# EAGLE board M837cc (EAGLE 6.6.0), part 1 of 2
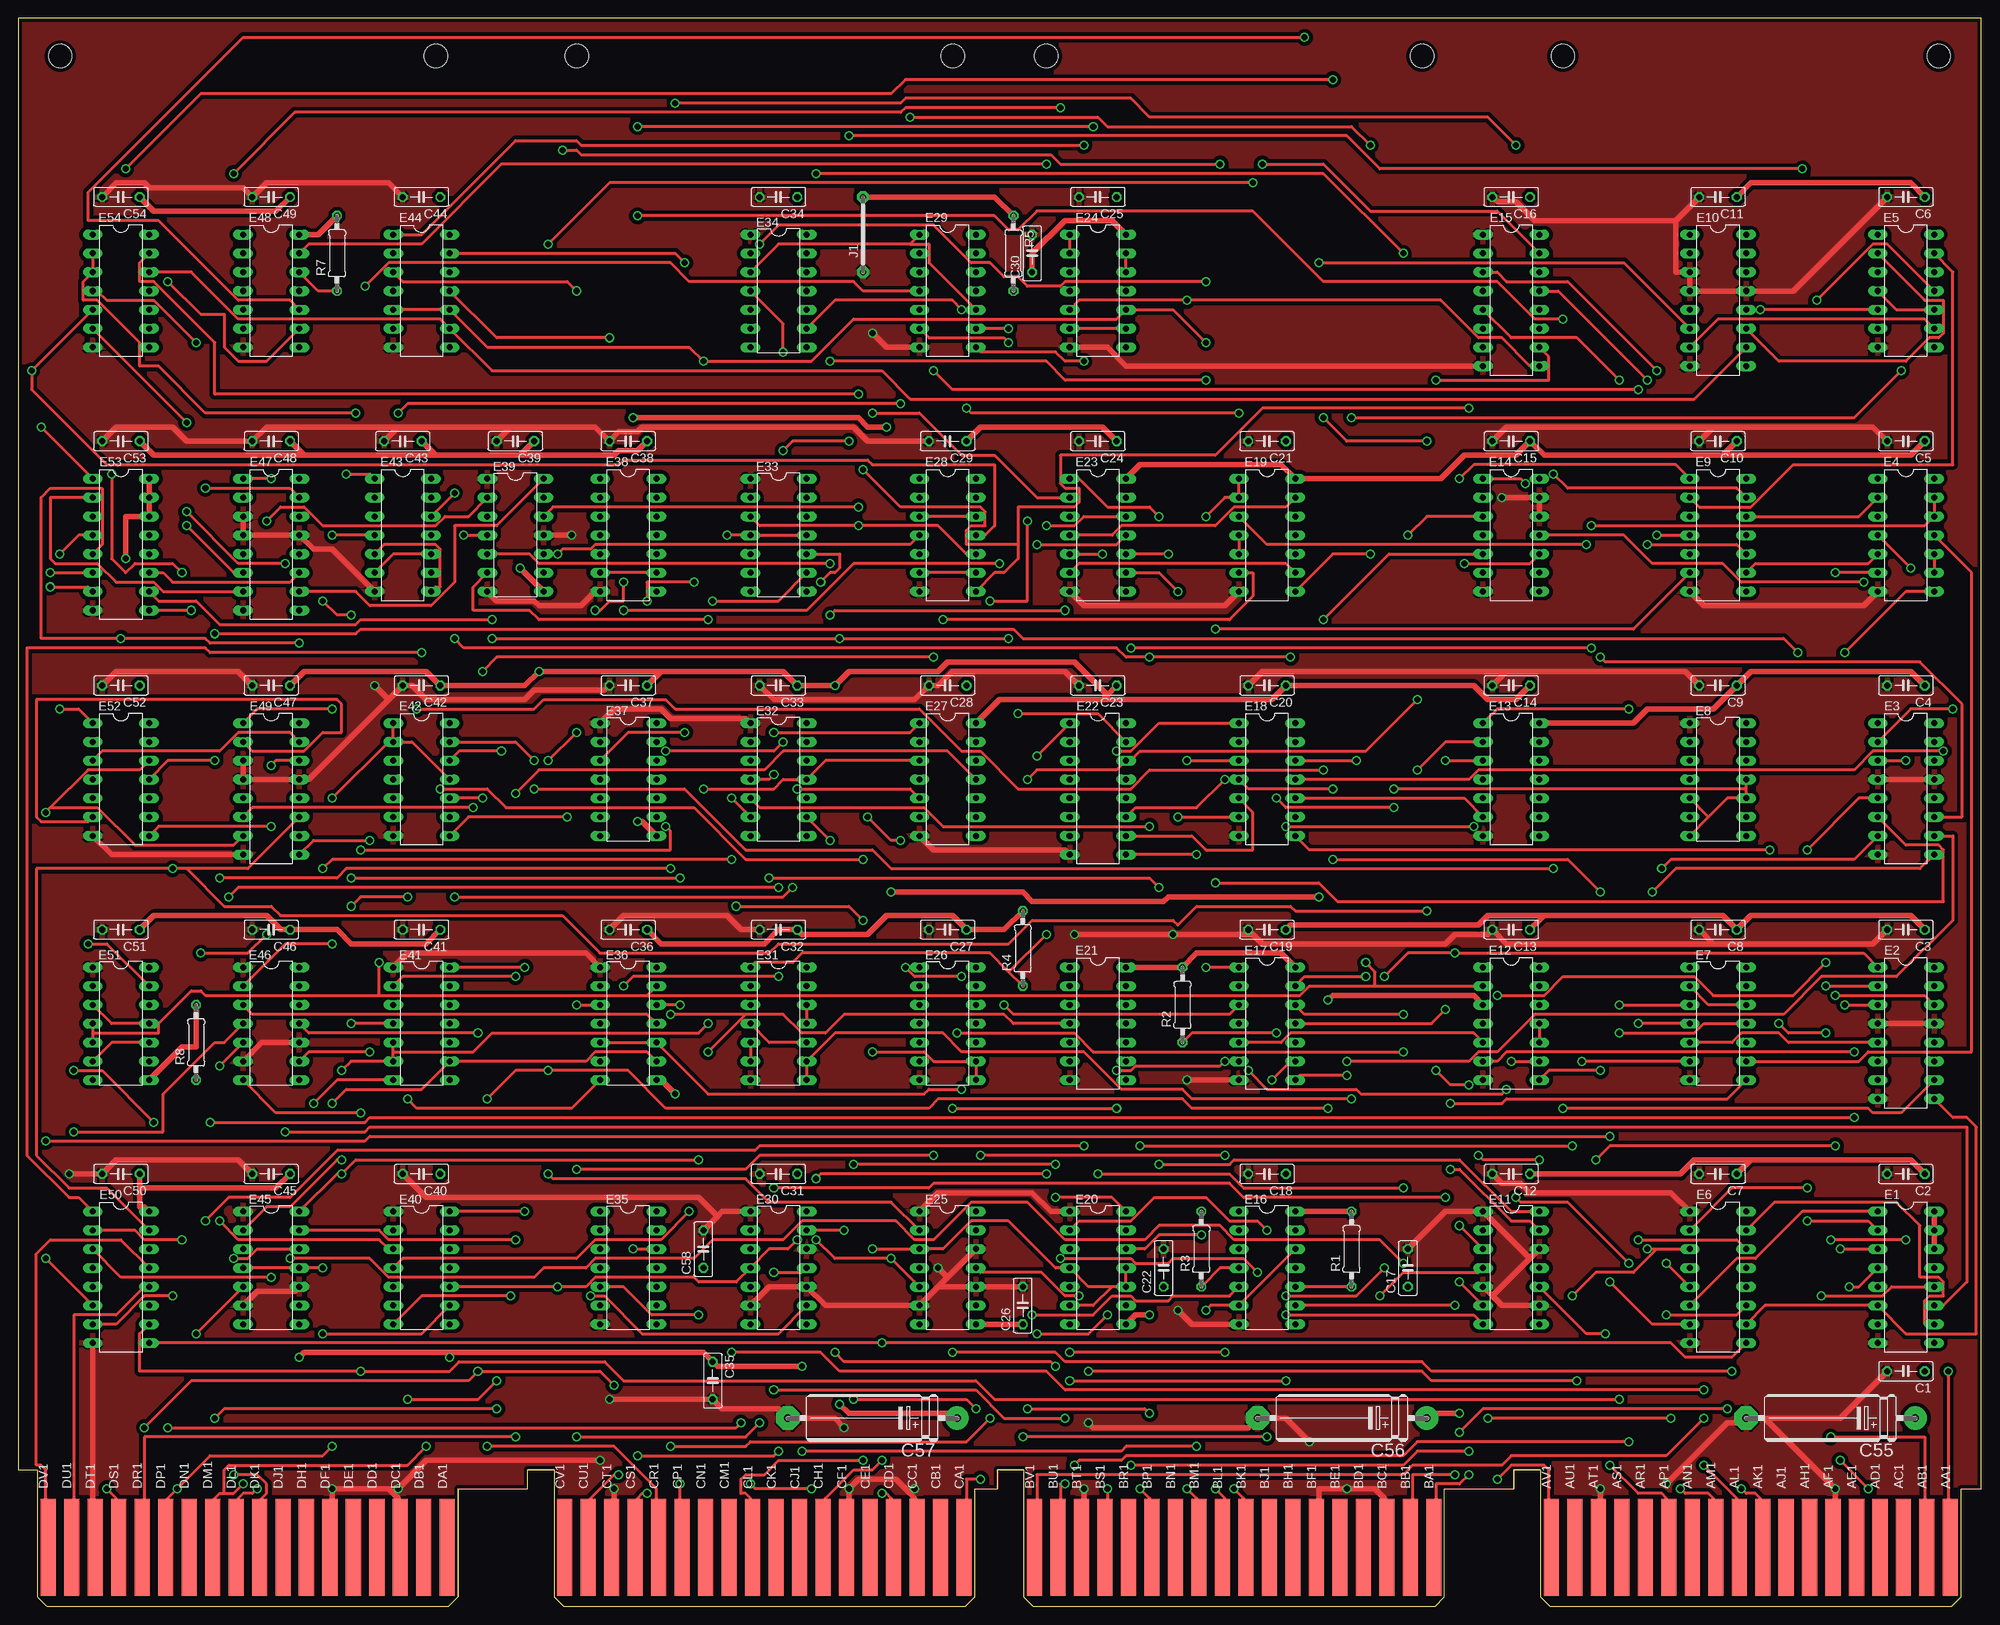
[diagram p7: board, top side]
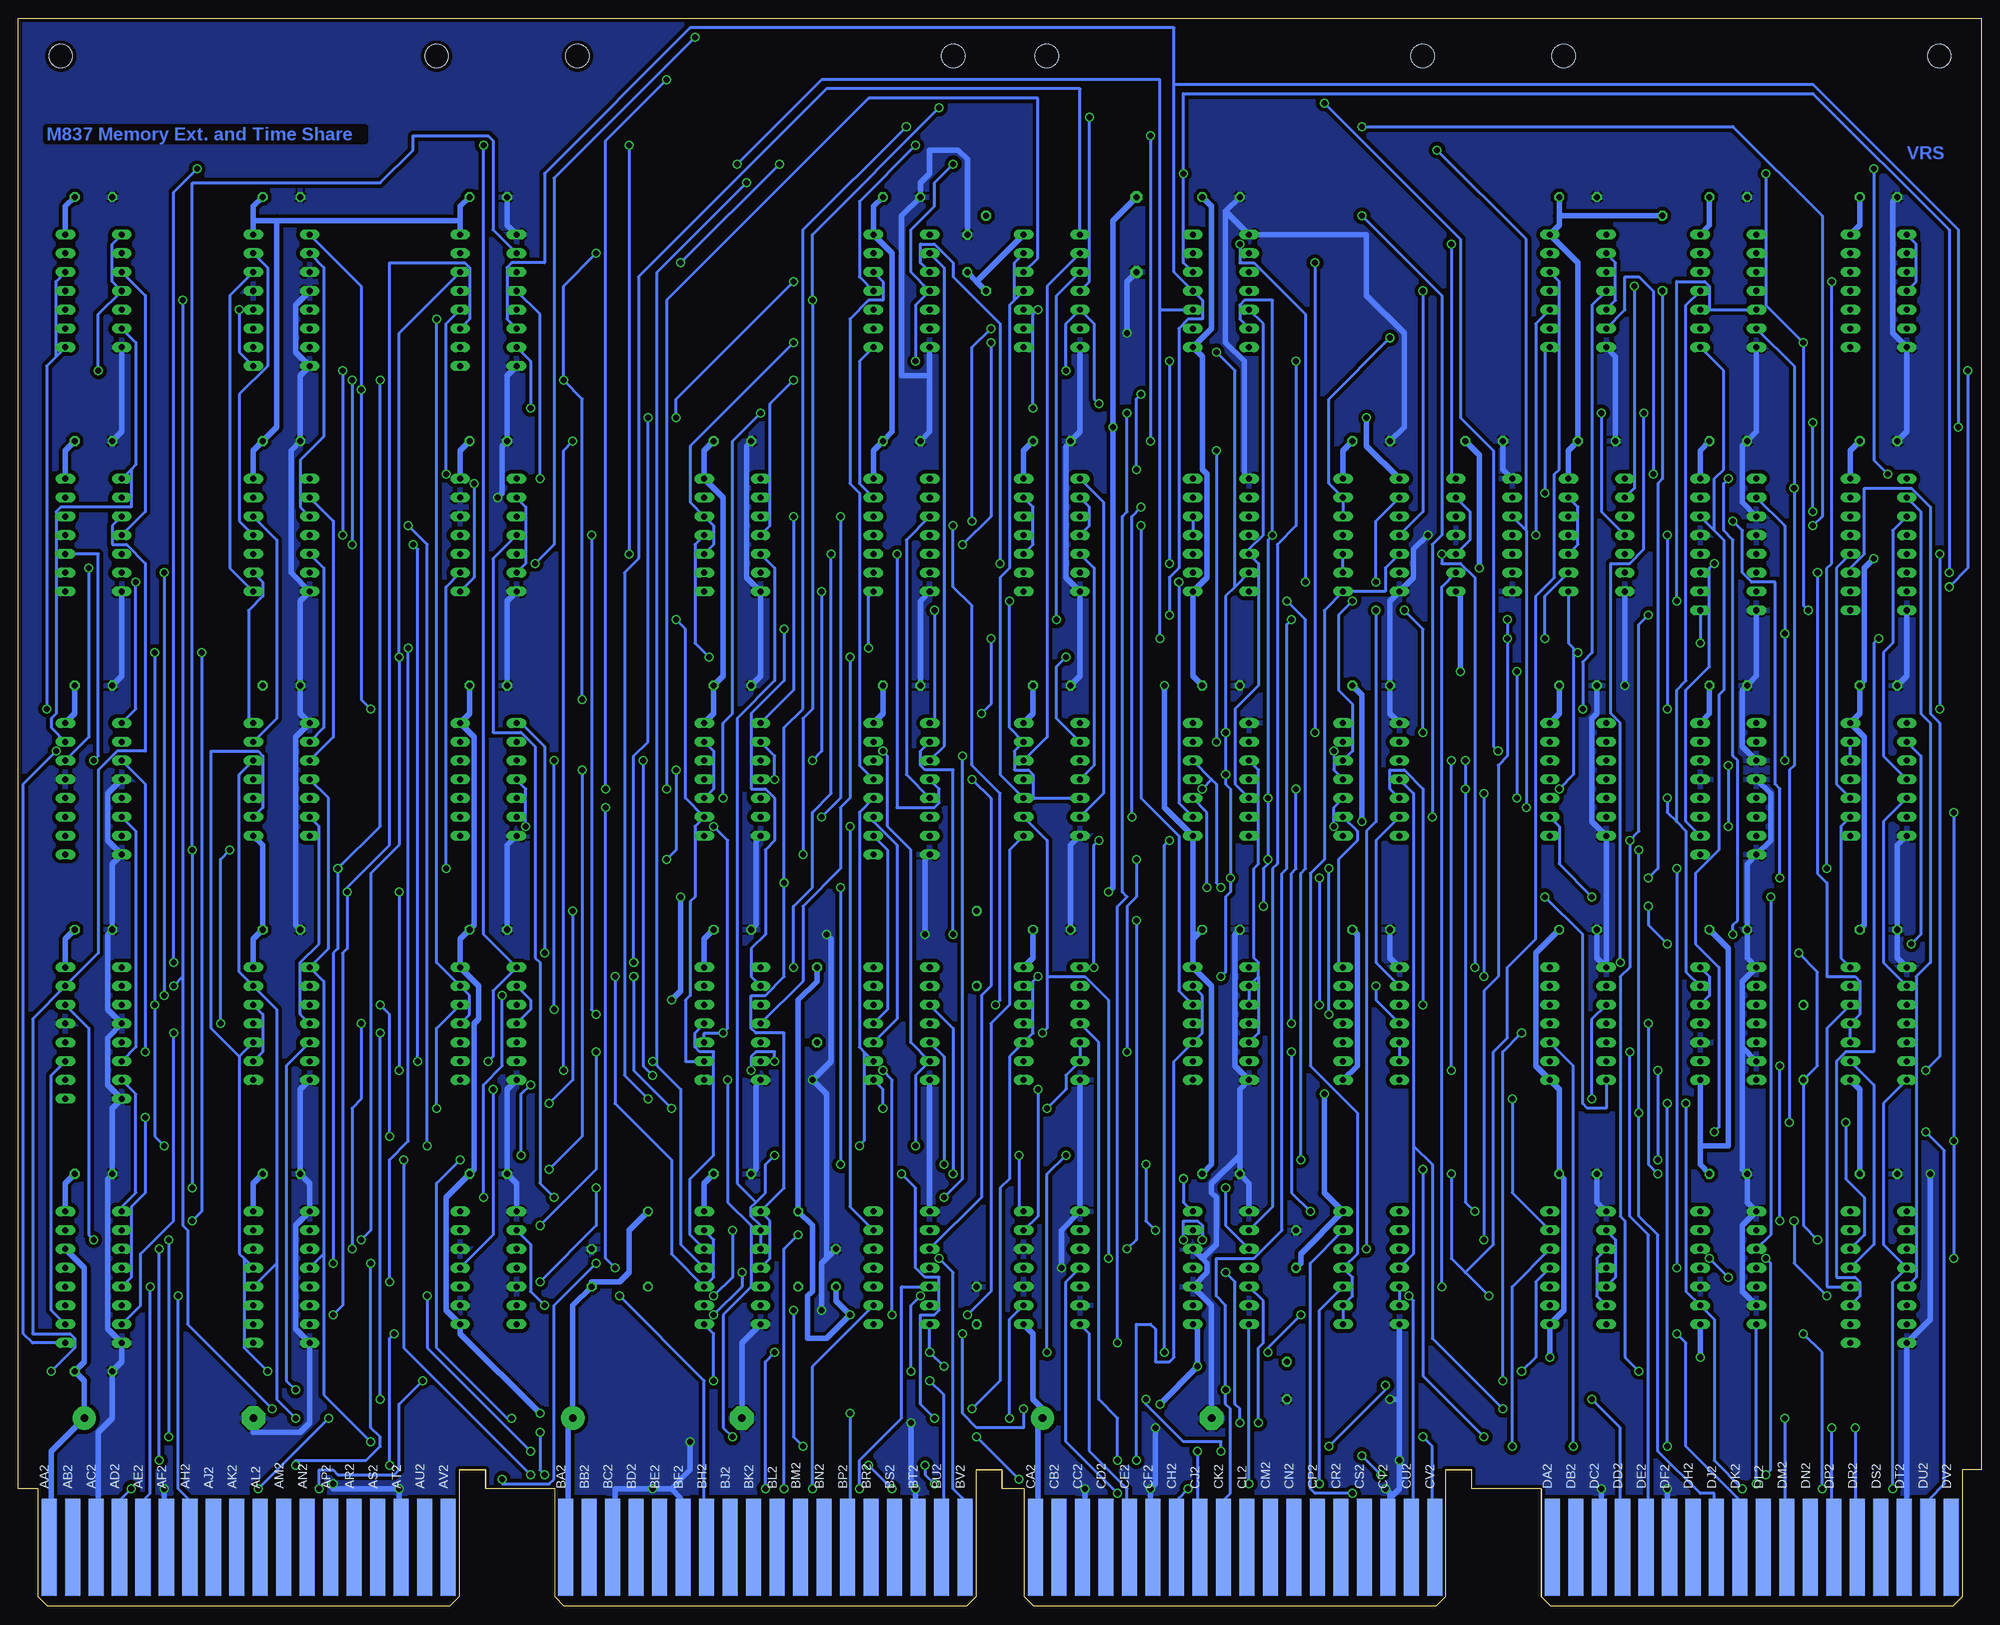
[diagram p8: board, bottom side, seen from below]

Size 265.3 x 214.63 mm. Coordinates in mm from the lower left corner, seen from the top.
Copper layers (1+16): Top 0.035mm / dielectric 1.5mm / Bottom 0.035mm
Design rules "16mils": minimum track width 16mil, minimum drill 32mil, track to track 15mil, track to pad 10mil, pad to pad 10mil, via to via 10mil, smd to smd 10mil, copper to edge 13mil, drill to drill 10mil, minimum pad ring 10mil, minimum via ring 8mil, stop-mask expansion 0mil, vias tented up to drill 0mil, thermal gap 10mil
Net classes: 1 Supply: width 0.762 mm, drill 0.762 mm, clearance 0.508 mm

## Footprints (pad centres in the part's own frame; a part is rotated, then mirrored left to right if it is on the bottom)
C050-025X075 = drill 0.813 octagon: 1 -2.54,0; 2 2.54,0
E22-6 = drill 1.016 pad 3.15: + -11.43,0 | drill 1.016 pad 3.15 octagon: - 11.43,0
DIL16 = drill 0.813 long: 1 -8.89,-3.81; 2 -6.35,-3.81; 3 -3.81,-3.81; 4 -1.27,-3.81; 5 1.27,-3.81; 6 3.81,-3.81; 7 6.35,-3.81; 8 8.89,-3.81; 9 8.89,3.81; 10 6.35,3.81; 11 3.81,3.81; 12 1.27,3.81; 13 -1.27,3.81; 14 -3.81,3.81; 15 -6.35,3.81; 16 -8.89,3.81
DIL14 = drill 0.813 long: 1 -7.62,-3.81; 2 -5.08,-3.81; 3 -2.54,-3.81; 4 0,-3.81; 5 2.54,-3.81; 6 5.08,-3.81; 7 7.62,-3.81; 8 7.62,3.81; 9 5.08,3.81; 10 2.54,3.81; 11 0,3.81; 12 -2.54,3.81; 13 -5.08,3.81; 14 -7.62,3.81
EDGE-CON8 = smd 2.032 x 13.106: AA1 261.303,7.938; AB1 258.127,7.938; AC1 254.952,7.938; AD1 251.778,7.938; AE1 248.602,7.938; AF1 245.428,7.938; AH1 242.252,7.938; AJ1 239.077,7.938; AK1 235.903,7.938; AL1 232.727,7.938; AM1 229.553,7.938; AN1 226.377,7.938; AP1 223.202,7.938; AR1 220.028,7.938; AS1 216.852,7.938; AT1 213.678,7.938; AU1 210.502,7.938; AV1 207.327,7.938; BA1 191.452,7.938; BB1 188.278,7.938; BC1 185.102,7.938; BD1 181.928,7.938; BE1 178.752,7.938; BF1 175.577,7.938; BH1 172.403,7.938; BJ1 169.227,7.938; BK1 166.053,7.938; BL1 162.877,7.938; BM1 159.702,7.938; BN1 156.528,7.938; BP1 153.352,7.938; BR1 150.178,7.938; BS1 147.002,7.938; BT1 143.827,7.938; BU1 140.653,7.938; BV1 137.477,7.938; CA1 127.953,7.938; CB1 124.778,7.938; CC1 121.603,7.938; CD1 118.427,7.938; CE1 115.252,7.938; CF1 112.078,7.938; CH1 108.903,7.938; CJ1 105.728,7.938; CK1 102.552,7.938; CL1 99.377,7.938; CM1 96.203,7.938; CN1 93.028,7.938; CP1 89.853,7.938; CR1 86.677,7.938; CS1 83.502,7.938; CT1 80.328,7.938; CU1 77.153,7.938; CV1 73.978,7.938; DA1 58.102,7.938; DB1 54.928,7.938; DC1 51.752,7.938; DD1 48.578,7.938; DE1 45.403,7.938; DF1 42.227,7.938; DH1 39.053,7.938; DJ1 35.877,7.938; DK1 32.703,7.938; DL1 29.527,7.938; DM1 26.352,7.938; DN1 23.177,7.938; DP1 20.003,7.938; DR1 16.828,7.938; DS1 13.652,7.938; DT1 10.477,7.938; DU1 7.303,7.938; DV1 4.128,7.938 | smd 2.032 x 13.106 bottom: AA2 261.303,7.938; AB2 258.127,7.938; AC2 254.952,7.938; AD2 251.778,7.938; AE2 248.602,7.938; AF2 245.428,7.938; AH2 242.252,7.938; AJ2 239.077,7.938; AK2 235.903,7.938; AL2 232.727,7.938; AM2 229.553,7.938; AN2 226.377,7.938; AP2 223.202,7.938; AR2 220.028,7.938; AS2 216.852,7.938; AT2 213.678,7.938; AU2 210.502,7.938; AV2 207.327,7.938; BA2 191.452,7.938; BB2 188.278,7.938; BC2 185.102,7.938; BD2 181.928,7.938; BE2 178.752,7.938; BF2 175.577,7.938; BH2 172.403,7.938; BJ2 169.227,7.938; BK2 166.053,7.938; BL2 162.877,7.938; BM2 159.702,7.938; BN2 156.528,7.938; BP2 153.352,7.938; BR2 150.178,7.938; BS2 147.002,7.938; BT2 143.827,7.938; BU2 140.653,7.938; BV2 137.477,7.938; CA2 127.953,7.938; CB2 124.778,7.938; CC2 121.603,7.938; CD2 118.427,7.938; CE2 115.252,7.938; CF2 112.078,7.938; CH2 108.903,7.938; CJ2 105.728,7.938; CK2 102.552,7.938; CL2 99.377,7.938; CM2 96.203,7.938; CN2 93.028,7.938; CP2 89.853,7.938; CR2 86.677,7.938; CS2 83.502,7.938; CT2 80.328,7.938; CU2 77.153,7.938; CV2 73.978,7.938; DA2 58.102,7.938; DB2 54.928,7.938; DC2 51.752,7.938; DD2 48.578,7.938; DE2 45.403,7.938; DF2 42.227,7.938; DH2 39.053,7.938; DJ2 35.877,7.938; DK2 32.703,7.938; DL2 29.527,7.938; DM2 26.352,7.938; DN2 23.177,7.938; DP2 20.003,7.938; DR2 16.828,7.938; DS2 13.652,7.938; DT2 10.477,7.938; DU2 7.303,7.938; DV2 4.128,7.938
10 = drill 0.813 pad 1.6 octagon: 1 -5.08,0; 2 5.08,0
0207/10 = drill 0.813 octagon: 1 -5.08,0; 2 5.08,0
OMNIBUS = hole 3.175: 208.915,209.55; 259.715,209.55; 189.865,209.55; 139.065,209.55; 75.616,209.55; 126.416,209.55; 56.566,209.55; 5.766,209.55

## Placement (x,y rotation side)
C1  .01uf  [C050-025X075]  255.14,31.75 180 top
C2  .01uf  [C050-025X075]  255.14,58.42 180 top
C3  .01uf  [C050-025X075]  255.14,91.44 180 top
C4  .01uf  [C050-025X075]  255.14,124.46 180 top
C5  .01uf  [C050-025X075]  255.14,157.48 180 top
C6  .01uf  [C050-025X075]  255.14,190.5 180 top
C7  .01uf  [C050-025X075]  229.74,58.42 180 top
C8  .01uf  [C050-025X075]  229.74,91.44 180 top
C9  .01uf  [C050-025X075]  229.74,124.46 180 top
C10  .01uf  [C050-025X075]  229.74,157.48 180 top
C11  .01uf  [C050-025X075]  229.74,190.5 180 top
C12  .01uf  [C050-025X075]  201.8,58.42 180 top
C13  .01uf  [C050-025X075]  201.8,91.44 180 top
C14  .01uf  [C050-025X075]  201.8,124.46 180 top
C15  .01uf  [C050-025X075]  201.8,157.48 180 top
C16  .01uf  [C050-025X075]  201.8,190.5 180 top
C17  .01uf  [C050-025X075]  187.83,45.72 90 top
C18  .01uf  [C050-025X075]  168.78,58.42 180 top
C19  .01uf  [C050-025X075]  168.78,91.44 180 top
C20  .01uf  [C050-025X075]  168.78,124.46 180 top
C21  .01uf  [C050-025X075]  168.78,157.48 180 top
C22  .01uf  [C050-025X075]  154.81,45.72 90 top
C23  .01uf  [C050-025X075]  145.92,124.46 180 top
C24  .01uf  [C050-025X075]  145.92,157.48 180 top
C25  .01uf  [C050-025X075]  145.92,190.5 180 top
C26  .01uf  [C050-025X075]  135.76,40.64 90 top
C27  .01uf  [C050-025X075]  125.6,91.44 180 top
C28  .01uf  [C050-025X075]  125.6,124.46 180 top
C29  .01uf  [C050-025X075]  125.6,157.48 180 top
C30  .01uf  [C050-025X075]  137.03,182.88 90 top
C31  .01uf  [C050-025X075]  102.74,58.42 180 top
C32  .01uf  [C050-025X075]  102.74,91.44 180 top
C33  .01uf  [C050-025X075]  102.74,124.46 180 top
C34  .01uf  [C050-025X075]  102.74,190.5 180 top
C35  .01uf  [C050-025X075]  93.85,30.48 270 top
C36  .01uf  [C050-025X075]  82.42,91.44 180 top
C37  .01uf  [C050-025X075]  82.42,124.46 180 top
C38  .01uf  [C050-025X075]  82.42,157.48 180 top
C39  .01uf  [C050-025X075]  67.18,157.48 180 top
C40  .01uf  [C050-025X075]  54.48,58.42 180 top
C41  .01uf  [C050-025X075]  54.48,91.44 180 top
C42  .01uf  [C050-025X075]  54.48,124.46 180 top
C43  .01uf  [C050-025X075]  51.94,157.48 180 top
C44  .01uf  [C050-025X075]  54.48,190.5 180 top
C45  .01uf  [C050-025X075]  34.16,58.42 180 top
C46  .01uf  [C050-025X075]  34.16,91.44 180 top
C47  .01uf  [C050-025X075]  34.16,124.46 180 top
C48  .01uf  [C050-025X075]  34.16,157.48 180 top
C49  .01uf  [C050-025X075]  34.16,190.5 180 top
C50  .01uf  [C050-025X075]  13.84,58.42 180 top
C51  .01uf  [C050-025X075]  13.84,91.44 180 top
C52  .01uf  [C050-025X075]  13.84,124.46 180 top
C53  .01uf  [C050-025X075]  13.84,157.48 180 top
C54  .01uf  [C050-025X075]  13.84,190.5 180 top
C55  6.8uf  [E22-6]  244.98,25.4 180 top
C56  6.8uf  [E22-6]  178.94,25.4 180 top
C57  6.8uf  [E22-6]  115.44,25.4 180 top
C58  .01uf  [C050-025X075]  92.58,48.26 90 top
E1  DEC8235  [DIL16]  255.14,44.45 270 top
E2  DEC8271  [DIL16]  255.14,77.47 270 top
E3  DEC8271  [DIL16]  255.14,110.49 270 top
E4  7400N  [DIL14]  255.14,144.78 270 top
E5  7400N  [DIL14]  255.14,177.8 270 top
E6  DEC8235  [DIL16]  229.74,44.45 270 top
E7  N8881N  [DIL14]  229.74,78.74 270 top
E8  SP384N  [DIL14]  229.74,111.76 270 top
E9  7400N  [DIL14]  229.74,144.78 270 top
E10  DEC8271  [DIL16]  229.74,176.53 270 top
E11  SP380N  [DIL14]  201.8,45.72 270 top
E12  7410N  [DIL14]  201.8,78.74 270 top
E13  74S74N  [DIL14]  201.8,111.76 270 top
E14  7400N  [DIL14]  201.8,144.78 270 top
E15  MC8266  [DIL16]  201.8,176.53 270 top
E16  N8881N  [DIL14]  168.78,45.72 270 top
E17  74S74N  [DIL14]  168.78,78.74 270 top
E18  74H00N  [DIL14]  168.78,111.76 270 top
E19  7400N  [DIL14]  168.78,144.78 270 top
E20  SP380N  [DIL14]  145.92,45.72 270 top
E21  7410N  [DIL14]  145.92,78.74 270 top
E22  DEC8251  [DIL16]  145.92,110.49 270 top
E23  7404N  [DIL14]  145.92,144.78 270 top
E24  7400N  [DIL14]  145.92,177.8 270 top
E25  SP384N  [DIL14]  125.6,45.72 270 top
E26  N8881N  [DIL14]  125.6,78.74 270 top
E27  7404N  [DIL14]  125.6,111.76 270 top
E28  7400N  [DIL14]  125.6,144.78 270 top
E29  7410N  [DIL14]  125.6,177.8 270 top
E30  SP384N  [DIL14]  102.74,45.72 270 top
E31  N8881N  [DIL14]  102.74,78.74 270 top
E32  SP314N  [DIL14]  102.74,111.76 270 top
E33  SP314N  [DIL14]  102.74,144.78 270 top
E34  SP314N  [DIL14]  102.74,177.8 270 top
E35  N8881N  [DIL14]  82.42,45.72 270 top
E36  SP380N  [DIL14]  82.42,78.74 270 top
E37  SP314N  [DIL14]  82.42,111.76 270 top
E38  7420  [DIL14]  82.42,144.78 270 top
E39  SP380N  [DIL14]  67.18,144.78 270 top
E40  SP380N  [DIL14]  54.48,45.72 270 top
E41  SP384N  [DIL14]  54.48,78.74 270 top
E42  7410N  [DIL14]  54.48,111.76 270 top
E43  7420  [DIL14]  51.94,144.78 270 top
E44  7400N  [DIL14]  54.48,177.8 270 top
E45  SP380N  [DIL14]  34.16,45.72 270 top
E46  SP380N  [DIL14]  34.16,78.74 270 top
E47  DEC8271  [DIL16]  34.16,143.51 270 top
E48  7404N  [DIL14]  34.16,177.8 270 top
E49  DEC8271  [DIL16]  34.16,110.49 270 top
E50  DEC8235  [DIL16]  13.84,44.45 270 top
E51  SP384N  [DIL14]  13.84,78.74 270 top
E52  7400N  [DIL14]  13.84,111.76 270 top
E53  MC8266  [DIL16]  13.84,143.51 270 top
E54  7410N  [DIL14]  13.84,177.8 270 top
EDGE  [EDGE-CON8]  -0.13,0 0 top
J1  J10MM  [10]  114.17,185.42 90 top
R1  1K  [0207/10]  180.21,48.26 90 top
R2  1K  [0207/10]  157.35,81.28 90 top
R3  1K  [0207/10]  159.89,48.26 90 top
R4  1K  [0207/10]  135.76,88.9 90 top
R5  1K  [0207/10]  134.49,182.88 270 top
R7  1K  [0207/10]  43.05,182.88 90 top
R8  1K  [0207/10]  24,76.2 90 top
U$1  OUTLINE-OMNIBUS  [OMNIBUS]  -0.13,0 0 top

## Tracks (layer width: path | path; a pad name or v marks a point on that pad's centre or on a via)
!(DF_ENAB*EMA_DISAB_L)  (via drill 0.81)
  Top 0.406: E18.8 174.5,102.23 v236.73,102.23 | v238,78.74 239.27,77.47 v244.35,77.47
  Bottom 0.406: v236.73,102.23 238,100.97 v238,78.74 | v244.35,77.47 244.35,52.07 248.79,47.62 248.79,40.64 E1.7
!(DF_ENAB_L*EMA_DISAB_L)  (via drill 0.81)
  Top 0.406: E18.11 196.09,111.76 197.36,113.03 248.16,113.03 250.7,115.57 v260.22,115.57
  Bottom 0.406: v260.22,115.57 264.67,111.12 264.67,36.83 263.4,35.56 E1.9
!(GTF+RIB)  (via drill 0.81)
  Top 0.406: E50.9 v116.71,35.56 223.39,35.56 225.3,33.66 231.65,33.66 E6.9 | E23.2 137.67,149.86 131.95,155.57 127.51,155.57 121.79,161.29 v115.44,161.29
  Bottom 0.406: v115.44,161.29 115.44,147.96 116.08,147.32 116.08,96.52 115.44,95.89 116.71,94.61 v116.71,35.56
!(IND+RIF)  (via drill 0.81)
  Top 0.406: v212.6,129.54 v150.37,129.54 | v215.14,43.81 220.85,38.1 E6.7
  Bottom 0.406: E23.8 150.37,136.53 v150.37,129.54 | v212.6,129.54 212.6,62.87 215.14,60.33 v215.14,43.81
!(LA+TP3)  (via drill 0.81)
  Top 0.406: E49.6 31.62,107.95 v61.47,107.95 | E10.6 217.04,181.61 v175.77,181.61 | v162.43,194.94 140.84,194.94 139.57,196.22 76.07,196.22 75.44,196.85 v73.53,196.85
  Bottom 0.406: 61.47,145.41 v61.47,107.95 | E39.3 61.47,145.41 | v162.43,194.94 v175.77,181.61 | v73.53,196.85 61.47,184.78 61.47,145.41
!(LA+TP4*LD_CTL)  (via drill 0.81)
  Top 0.406: R3.1 162.43,45.72 E16.4 | E47.6 29.08,139.7 v22.73,146.05 | v145.29,200.03 v83.69,200.03 | E3.6 255.14,102.87 259.59,102.87 260.22,102.23 260.22,95.25 178.31,95.25 175.77,97.79 v161.8,97.79
  Bottom 0.406: E2.6 249.43,75.56 249.43,104.78 E3.6 | E16.4 163.7,46.99 163.7,52.07 E16.1 161.8,56.52 161.8,77.47 165.61,77.47 166.24,78.11 166.24,82.55 164.34,82.55 161.8,85.09 v161.8,97.79 161.8,118.75 159.26,121.28 159.26,186.06 v145.29,200.03 | v22.73,146.05 21.46,147.32 21.46,187.96 33.53,200.03 v83.69,200.03
![D_IN+D(JMP+JMS)+(F*MD3)(JMP+JMS)]  (via drill 0.81)
  Top 0.406: v208.79,67.31 250.06,67.31 250.7,66.67 254.51,66.67 E2.10
  Bottom 0.406: E12.12 208.79,78.11 v208.79,67.31
!BMD02  (via drill 0.81)
  Top 0.406: E36.5 E36.10 93.22,69.22 122.43,69.22 123.06,69.85 v127.51,69.85
  Bottom 0.406: E36.5 E36.6 | E25.13 127.51,52.7 v127.51,69.85
!BUF_D_IN  (via drill 0.81)
  Top 0.406: E51.6 12.57,76.2 E51.10 | E51.3 12.57,78.74 E51.11 | 228.47,106.68 231.01,109.22 E8.10 233.55,110.49 | 228.47,106.68 E8.7 | 228.47,106.68 E8.5 | 233.55,110.49 E8.11 | v22.1,139.7 20.83,140.97 15.75,140.97 14.48,139.7 12.57,141.6 v12.57,153.03 | v14.48,194.31 24.64,204.47 117.98,204.47 119.89,206.38 v177.67,206.38 | 233.55,110.49 v185.93,110.49
  Bottom 0.406: E51.10 E51.11 16.38,80.01 16.38,84.45 17.02,85.09 20.83,85.09 20.83,97.79 22.1,99.06 v22.1,139.7 | v12.57,153.03 14.48,154.94 v14.48,194.31 | v177.67,206.38 185.93,198.12 v185.93,110.49
!CDF  (via drill 0.81)
  Top 0.406: E53.7 9.4,137.79 v4.32,137.79 | E54.5 v1.78,167 1.78,164.47 11.94,154.31 81.15,154.31 81.79,154.94 114.81,154.94 115.44,154.31 131.95,154.31 131.95,146.05 130.68,144.78 E28.11
  Bottom 0.406: v4.32,137.79 1.78,140.34 v1.78,167
!CIF  (via drill 0.81)
  Top 0.406: E28.8 131.95,139.7 133.22,139.7 135.13,141.6 135.13,143.51 | 135.13,143.51 135.13,148.59 142.75,148.59 143.38,149.22 143.38,151.13 141.48,151.13 140.84,151.76 140.84,155.57 161.8,155.57 168.15,161.93 v196.09,161.93 | E54.13 16.38,181.61 16.38,179.07 18.29,179.07 26.54,170.81 26.54,163.83 v113.54,163.83 | v114.17,153.67 119.25,148.59 130.05,148.59 130.68,147.96 130.68,146.05 128.78,146.05 128.14,145.41 128.14,143.51 135.13,143.51
  Bottom 0.406: v196.09,161.93 196.09,168.28 E15.7 | v113.54,163.83 114.17,163.19 v114.17,153.67
!CINT
  Top 0.406: E24.12 E24.13
  Bottom 0.406: E22.13 151.64,113.67 151.64,150.5 152.91,151.76 152.91,173.99 150.37,176.53 148.46,176.53 148.46,179.07 E24.12
!CPMA_DISABLE  (via drill 0.81)
  Top 0.406: v201.17,69.85 200.53,69.22 181.48,69.22 180.85,69.85 168.78,69.85 v166.24,72.39 | v163.07,73.66 162.43,73.03 151,73.03 150.37,72.39 v148.46,72.39 | v147.19,39.37 144.65,36.83 v137.67,36.83 | v129.41,26.67 128.14,27.94 v112.9,27.94 | v102.74,20.95 102.11,20.32 v83.69,20.32 | v81.15,17.78 80.52,17.78 77.34,14.61 77.34,8.26 EDGE.CU1
  Bottom 0.406: E11.11 201.17,50.16 v201.17,69.85 | v166.24,72.39 166.24,74.3 165.61,74.93 163.07,74.93 v163.07,73.66 | v148.46,72.39 147.19,71.12 v147.19,39.37 | v137.67,36.83 137.67,26.04 135.76,24.13 129.41,24.13 v129.41,26.67 | v112.9,27.94 112.9,27.3 107.82,22.23 102.74,22.23 v102.74,20.95 | v81.15,17.78 v83.69,20.32
!CUF  (via drill 0.81)
  Top 0.406: E23.5 v146.56,142.24
  Bottom 0.406: E22.4 140.84,110.49 140.84,108.58 141.48,107.95 146.56,107.95 v146.56,142.24
!D  (via drill 0.81)
  Top 0.406: E40.9 54.48,36.83 v41.15,36.83
  Bottom 0.406: v41.15,36.83 39.88,35.56 39.88,21.59 32.89,14.61 32.89,8.26 EDGE.DK2
!D_IN  (via drill 0.81)
  Top 0.406: E5.10 253.87,175.26 E5.4 | E54.2 E54.3 8.76,179.07 8.76,176.53 10.67,176.53 16.38,170.81 16.38,167.64 18.92,167.64 25.27,161.29 v45.59,161.29 | E51.4 10.03,77.47 | 10.03,77.47 E51.5 | 84.96,82.55 E36.13 | 48.77,82.55 25.27,82.55 24.64,83.19 23.37,83.19 18.92,78.74 18.92,77.47 10.03,77.47 | 48.77,82.55 84.96,82.55 | 48.77,82.55 v48.77,87 | 183.39,83.82 174.5,83.82 173.23,82.55 84.96,82.55 | 183.39,83.82 E12.2 | v254.51,167 248.16,160.66 v180.21,160.66 | v182.12,87 183.39,85.72 183.39,83.82
  Bottom 0.406: E5.1 252.6,184.15 252.6,179.07 E5.4 254.51,174.62 v254.51,167 | E12.4 196.09,80.64 196.09,81.92 E12.2 | v45.59,161.29 45.59,142.88 47.5,140.97 50.04,140.97 50.04,120.65 48.77,119.38 v48.77,87 | v180.21,160.66 180.21,116.84 182.12,114.94 v182.12,87
!DATA03  (via drill 0.81)
  Top 0.406: E50.3 13.84,44.45 v34.16,44.45 | v36.7,46.99 47.5,46.99 50.04,44.45 69.72,44.45 70.99,45.72 76.71,45.72 77.98,46.99 91.31,46.99 93.85,49.53 103.38,49.53 105.92,52.07 118.62,52.07 121.16,49.53 123.7,49.53 128.78,54.61 136.4,54.61 141.48,49.53 152.27,49.53 154.18,51.44 162.43,51.44 164.34,49.53 184.02,49.53 v187.2,46.35 | v199.9,17.14 201.8,19.05 206.25,19.05 206.88,18.41 206.88,8.26 EDGE.AV1
  Bottom 0.406: v36.7,46.99 v34.16,44.45 | v187.2,46.35 192.91,40.64 192.91,17.14 193.55,16.51 199.9,16.51 v199.9,17.14
!DATA05  (via drill 0.81)
  Top 0.406: v220.22,48.26 221.49,48.26 | 221.49,48.26 E6.3 | E7.4 v218.95,78.74 | v147.19,15.88 147.19,8.26 EDGE.BS1 | v150.37,19.05 187.2,19.05 189.1,20.95 v196.09,20.95 | v210.06,41.91 213.23,45.09 218.31,45.09 221.49,48.26
  Bottom 0.406: v220.22,48.26 220.22,67.31 218.95,68.58 v218.95,78.74 | E8.6 224.66,105.41 224.66,89.53 227.2,87 227.2,80.01 E7.4 | v150.37,19.05 v147.19,15.88 | v196.09,20.95 210.06,34.92 v210.06,41.91
!DATA06  (via drill 0.81)
  Top 0.406: v141.48,16.51 140.84,16.51 140.84,8.26 EDGE.BU1 | v142.75,19.05 143.38,19.68 149.1,19.68 149.73,20.32 187.2,20.32 189.1,22.23 v217.68,22.23
  Bottom 0.406: 224.03,47.62 E6.4 | 224.03,47.62 224.03,84.45 E7.1 223.39,88.9 223.39,109.22 E8.4 | v141.48,16.51 142.75,17.78 v142.75,19.05 | v217.68,22.23 224.03,28.57 224.03,47.62
!DATA07  (via drill 0.81)
  Top 0.406: v227.84,25.4 222.76,20.32 201.8,20.32 200.53,19.05 188.47,19.05 187.2,17.78 137.67,17.78 137.67,8.26 EDGE.BV1
  Bottom 0.406: 230.38,46.35 E6.12 | 230.38,46.35 230.38,80.64 E7.13 235.46,85.72 235.46,112.39 E8.12 | v227.84,25.4 230.38,27.94 230.38,46.35
!DATA08  (via drill 0.81)
  Top 0.406: v67.18,22.86 17.02,22.86 17.02,8.26 EDGE.DR1 | v75.44,59.05 98.3,59.05 100.2,60.96 v123.7,60.96 | v126.24,34.29 140.21,34.29 141.48,33.02 189.74,33.02 191.01,31.75 v231.65,31.75
  Bottom 0.406: 234.82,46.99 235.46,47.62 235.46,74.3 | 234.82,46.99 E6.13 | E7.10 235.46,74.3 | E8.9 232.28,107.95 232.28,114.94 232.92,115.57 239.27,115.57 239.27,78.11 235.46,74.3 | v67.18,22.86 75.44,31.11 v75.44,59.05 | v123.7,60.96 126.24,58.42 v126.24,34.29 | v231.65,31.75 234.82,34.92 234.82,46.99
!DATA09  (via drill 0.81)
  Top 0.406: v11.94,15.88 13.21,14.61 13.21,8.26 EDGE.DS1
  Bottom 0.406: E51.7 13.21,67.94 13.21,48.9 E50.4 11.94,43.81 v11.94,15.88
!DATA10
  Top 0.406: E50.12 17.02,43.18 13.21,39.37 7.49,39.37 7.49,8.26 EDGE.DU1
  Bottom 0.406: E50.12 20.83,43.18 20.83,78.11 E51.12
!DATA11
  Top 0.406: E50.13 13.84,49.53 4.32,49.53 2.41,47.62 2.41,19.05 3.05,19.05 3.68,18.41 3.68,8.26 EDGE.DV1
  Bottom 0.406: E50.13 14.48,48.9 14.48,70.48 E51.9
!DF_ENABLE  (via drill 0.81)
  Top 0.406: E17.8 173.23,71.75 v179.58,71.75 | E18.12 v180.85,114.3
  Bottom 0.406: v179.58,71.75 180.85,73.03 v180.85,114.3
!EMA0  (via drill 0.81)
  Top 0.406: v246.25,48.26 E1.3 | v250.06,15.88 v246.25,19.68
  Bottom 0.406: v246.25,19.68 v246.25,48.26 | v250.06,15.88 251.33,14.61 251.33,8.26 EDGE.AD2
!EMA1  (via drill 0.81)
  Top 0.406: E1.4 248.79,43.18 v247.52,43.18
  Bottom 0.406: v247.52,43.18 247.52,15.24 248.16,14.61 248.16,8.26 EDGE.AE2
!EMA2  (via drill 0.81)
  Top 0.406: E1.12 253.24,43.18 251.97,41.91 v243.71,41.91
  Bottom 0.406: v243.71,41.91 243.71,15.88 242.44,14.61 242.44,8.26 EDGE.AH2
!EMA_DISABLE
  Top 0.406: E13.6 195.45,109.22 E18.10
  Bottom 0.406: E18.10 171.32,110.49 171.32,115.57 E18.13
!EXT_LD  (via drill 0.81)
  Top 0.406: v27.18,73.03 E46.5 | v27.18,52.07 29.72,49.53 48.77,49.53 50.04,48.26 E40.3
  Bottom 0.406: E40.6 51.94,41.91 51.94,46.99 E40.3 | v27.18,52.07 v27.18,73.03
!F  (via drill 0.81)
  Top 0.406: E46.7 34.8,66.67 v46.23,66.67 | v87.5,105.41 88.14,104.78 88.14,102.23 v46.23,102.23
  Bottom 0.406: EDGE.DJ2 36.07,8.26 36.07,15.24 37.97,15.24 43.69,20.95 43.69,50.16 46.23,52.7 v46.23,66.67 v46.23,102.23 | E37.10 87.5,107.95 v87.5,105.41
!F_SET  (via drill 0.81)
  Top 0.406: v97.66,24.77 97.03,24.13 v20.19,24.13
  Bottom 0.406: E30.5 97.03,41.27 97.03,35.56 97.66,34.92 v97.66,24.77 | v20.19,24.13 20.19,8.26 EDGE.DP2
!GTF  (via drill 0.81)
  Top 0.406: E18.4 166.24,110.49 v177.67,110.49
  Bottom 0.406: v177.67,110.49 177.67,176.53 150.37,203.84 127.51,203.84 127.51,182.25 E29.12
!IBIFDF_CLR  (via drill 0.81)
  Top 0.406: E49.1 32.26,121.28 v42.42,121.28 | E43.4 v42.42,144.78 | R1.1 E16.10 | E13.1 199.9,121.28 v217.68,121.28 | v123.7,167 126.24,164.47 v218.95,164.47 | E2.1 249.43,88.27 v194.18,88.27 187.83,88.27 v184.66,85.09 | v51.31,161.29 52.58,162.56 v119.25,162.56
  Bottom 0.406: v42.42,144.78 v42.42,121.28 | E16.13 171.32,49.53 171.32,44.45 E16.10 177.04,47.62 177.04,60.33 184.66,67.94 v184.66,85.09 | v217.68,121.28 218.95,122.56 v218.95,164.47 218.95,178.44 E10.1 | v123.7,167 123.7,173.35 E29.5 119.89,173.35 119.89,163.19 v119.25,162.56 | v194.18,88.27 194.18,116.2 197.36,119.38 E13.1 | E43.4 51.31,147.96 v51.31,161.29
!IND  (via drill 0.81)
  Top 0.406: v160.53,147.32 163.07,149.86 E19.2 E19.1 | E50.7 13.21,38.1 17.02,41.91 v20.83,41.91 | v25.27,52.07 28.45,55.24 36.7,55.24 43.05,61.59 99.57,61.59 100.2,62.23 v144.02,62.23 | E18.1 154.18,119.38 150.37,115.57 v148.46,115.57
  Bottom 0.406: E18.1 160.53,123.83 v160.53,147.32 | v20.83,41.91 25.27,46.35 v25.27,52.07 | v144.02,62.23 144.02,71.75 E21.6 144.65,76.2 144.65,102.23 147.83,105.41 147.83,114.94 v148.46,115.57
!IND1  (via drill 0.81)
  Top 0.406: E30.9 102.74,36.83 84.33,36.83 79.25,41.91 v77.34,41.91
  Bottom 0.406: v77.34,41.91 76.71,41.27 76.71,8.26 EDGE.CU2
!IND2  (via drill 0.81)
  Top 0.406: E30.11 105.92,45.09 v102.11,45.09 | v100.2,24.77 98.3,22.86 v75.44,22.86
  Bottom 0.406: v102.11,45.09 100.84,43.81 100.84,27.3 100.2,26.67 v100.2,24.77 | v75.44,22.86 74.17,21.59 74.17,8.26 EDGE.CV2
!INITIALIZE  (via drill 0.81)
  Top 0.406: v63.37,68.58 67.18,72.39 v71.63,72.39 82.42,72.39 87.5,67.31 123.06,67.31 124.33,68.58 157.35,68.58 158.62,67.31 v177.04,67.31 | v182.12,85.09 173.86,85.09 E17.13 | v81.79,138.43 81.79,135.89 79.88,135.89 78.61,134.62 v77.98,134.62 | v71.63,114.3 v75.44,118.11
  Bottom 0.406: E40.13 63.37,55.88 v63.37,68.58 | v177.04,67.31 182.12,72.39 v182.12,85.09 | E38.2 81.79,146.69 v81.79,138.43 | v77.98,134.62 75.44,132.08 v75.44,118.11 | v71.63,72.39 v71.63,114.3
!INT_IN_PROGRESS  (via drill 0.81)
  Top 0.406: E39.12 72.26,148.59 v113.54,148.59 | v114.81,106.68 117.98,103.5 v119.25,103.5 | v119.89,86.36 121.16,85.09 v127.51,85.09 | v152.91,26.04 152.27,26.67 v136.4,26.67
  Bottom 0.406: v113.54,148.59 114.81,147.32 v114.81,106.68 | v119.25,103.5 119.89,102.87 v119.89,86.36 | v127.51,85.09 128.14,84.45 128.14,77.47 E26.10 131.32,74.3 131.32,57.78 132.59,56.52 132.59,30.48 v136.4,26.67 | v152.91,26.04 152.91,8.26 EDGE.BP2
!INT_RQST  (via drill 0.81)
  Top 0.406: v89.41,16.51 89.41,8.26 EDGE.CP1
  Bottom 0.406: E35.10 89.41,40.01 v89.41,16.51
!INTERNAL_IO  (via drill 0.81)
  Top 0.406: E31.4 101.47,76.2 E31.10 | v114.17,19.68 102.74,19.68 100.84,17.78 98.3,17.78 97.66,17.14 97.66,15.24 98.3,15.24 98.93,14.61 98.93,8.26 EDGE.CL1
  Bottom 0.406: E31.13 105.28,82.55 105.28,77.47 E31.10 109.09,73.66 109.09,33.66 109.73,33.02 111.63,33.02 111.63,37.47 112.27,38.1 114.17,38.1 v114.17,19.68
!IO_PAUSE  (via drill 0.81)
  Top 0.406: v116.71,15.24 117.35,15.24 117.98,14.61 117.98,8.26 EDGE.CD1
  Bottom 0.406: E25.4 123.7,43.81 123.7,22.23 v116.71,15.24
!IOT010XXX1XX  (via drill 0.81)
  Top 0.406: E31.1 99.57,87 104.65,87 105.92,88.27 131.32,88.27 133.86,85.72 | R4.1 133.86,85.72 | 133.86,85.72 v138.94,90.81
  Bottom 0.406: E22.2 143.38,115.57 143.38,113.67 142.75,113.03 138.94,113.03 v138.94,90.81
!IR00  (via drill 0.81)
  Top 0.406: E46.11 39.24,77.47 v62.1,77.47 | v64.64,30.48 62.1,27.94 v52.58,27.94
  Bottom 0.406: v62.1,77.47 64.64,74.93 v64.64,30.48 | v52.58,27.94 48.77,24.13 48.77,8.26 EDGE.DD2
!IR01  (via drill 0.81)
  Top 0.406: E46.9 39.24,74.93 v47.5,74.93
  Bottom 0.406: v47.5,74.93 47.5,52.7 44.96,50.16 44.96,8.26 EDGE.DE2
!KEY_CTL  (via drill 0.81)
  Top 0.406: E46.4 27.81,76.2 26.54,76.2 19.56,69.22 19.56,64.14 v7.49,64.14
  Bottom 0.406: v7.49,64.14 4.95,61.59 4.95,16.51 6.86,14.61 6.86,8.26 EDGE.DU2
!LOAD_CNTL  (via drill 0.81)
  Top 0.406: E40.10 v72.9,43.18 76.71,43.18 77.98,44.45 91.31,44.45 91.95,43.81 97.03,43.81 E30.4 101.47,48.26 104.01,48.26 v105.28,49.53 | E25.5 v117.98,46.99 110.36,46.99 v107.82,49.53 | v194.82,51.44 E11.3 | v187.2,74.93 145.29,74.93 142.75,77.47 v126.87,77.47
  Bottom 0.406: E39.9 72.9,137.79 v72.9,43.18 | v117.98,46.99 117.98,81.92 121.16,85.09 126.24,85.09 | 126.24,85.09 126.24,103.5 E27.9 | v194.82,51.44 187.2,59.05 v187.2,74.93 | v126.87,77.47 126.24,78.11 126.24,85.09 | v105.28,49.53 105.28,51.44 105.92,52.07 107.82,52.07 v107.82,49.53
!MD00  (via drill 0.81)
  Top 0.406: v84.96,135.89 84.96,138.43 v91.31,138.43 | v100.2,184.15 102.74,186.69 123.7,186.69 128.78,181.61 131.32,181.61 133.22,179.71 135.13,179.71 136.4,178.44 140.84,178.44 141.48,179.07 v160.53,179.07 | v176.4,160.66 179.58,157.48 v190.37,157.48 | v191.64,72.39 193.55,70.48 v196.09,70.48 | v197.36,60.96 197.99,60.33 v205.61,60.33 | v223.39,25.4 v198.63,25.4 | v232.92,15.88 233.55,15.24 234.82,15.24 235.46,14.61 235.46,8.26 EDGE.AK1
  Bottom 0.406: E37.12 84.96,115.57 84.96,121.92 86.87,123.83 86.87,133.99 v84.96,135.89 | v91.31,138.43 91.31,174.62 98.3,181.61 100.2,181.61 v100.2,184.15 | v160.53,179.07 176.4,163.19 v176.4,160.66 | v190.37,157.48 191.64,156.21 v191.64,72.39 | v196.09,70.48 197.36,69.22 v197.36,60.96 | v205.61,60.33 208.79,57.15 208.79,34.92 199.26,25.4 v198.63,25.4 | v232.92,15.88 v223.39,25.4
!MD01  (via drill 0.81)
  Top 0.406: v87.5,115.57 102.11,115.57 v103.38,116.84 | v103.38,156.21 104.65,157.48 v112.27,157.48 | v112.27,198.75 179.58,198.75 184.02,194.31 v241.17,194.31 | v244.35,87 239.9,82.55 229.11,82.55 226.57,85.09 208.79,85.09 206.25,82.55 v199.9,82.55 | v202.44,55.24 203.07,54.61 209.42,54.61 v217.68,46.35 | v227.84,19.05 232.28,14.61 232.28,8.26 EDGE.AL1
  Bottom 0.406: E37.11 87.5,113.03 v87.5,115.57 | v103.38,156.21 v103.38,116.84 | v112.27,198.75 v112.27,157.48 | v241.17,194.31 244.35,191.13 v244.35,87 | v199.9,82.55 199.9,73.03 202.44,70.48 v202.44,55.24 | v217.68,46.35 217.68,24.13 216.41,22.86 216.41,21.59 218.31,19.68 227.84,19.68 v227.84,19.05
!MD02  (via drill 0.81)
  Top 0.406: E25.11 130.05,45.09 138.3,45.09 141.48,41.91 v143.38,41.91 | v144.65,31.75 189.74,31.75 191.01,30.48 v210.69,30.48 | v224.66,15.88 225.3,15.24 228.47,15.24 229.11,14.61 229.11,8.26 EDGE.AM1
  Bottom 0.406: v143.38,41.91 144.65,40.64 v144.65,31.75 | v210.69,30.48 213.87,27.3 213.87,18.41 214.5,17.78 222.12,17.78 222.76,18.41 224.66,18.41 v224.66,15.88
!MD03  (via drill 0.81)
  Top 0.406: E11.10 211.96,36.83 v214.5,36.83 | v215.14,19.05 218.95,15.24 222.12,15.24 222.76,14.61 222.76,8.26 EDGE.AP1
  Bottom 0.406: v214.5,36.83 215.14,36.2 v215.14,19.05
!MD04  (via drill 0.81)
  Top 0.406: v108.46,138.43 109.73,139.7 110.36,139.7 111,140.34 111,142.24 E33.10 | v163.07,34.29 v142.11,34.29 | v164.34,15.88 165.61,14.61 165.61,8.26 EDGE.BK1 | v109.73,103.5 E32.9 | v110.36,34.29 111.63,33.02 139.57,33.02 v140.21,32.38
  Bottom 0.406: E32.9 108.46,108.58 v108.46,138.43 | E20.7 v142.11,34.29 v140.21,32.38 | v163.07,34.29 164.34,33.02 v164.34,15.88 | v109.73,103.5 110.36,102.87 v110.36,34.29
!MD05  (via drill 0.81)
  Top 0.406: E20.12 152.27,48.26 154.18,50.16 v159.89,50.16 | v161.8,15.88 163.07,14.61 163.07,8.26 EDGE.BL1
  Bottom 0.406: v159.89,50.16 161.8,48.26 v161.8,15.88
!MD06  (via drill 0.81)
  Top 0.406: v157.99,15.88 159.26,14.61 159.26,8.26 EDGE.BM1
  Bottom 0.406: E20.9 157.99,32.38 v157.99,15.88
!MD07  (via drill 0.81)
  Top 0.406: v151.64,15.88 152.91,14.61 152.91,8.26 EDGE.BP1
  Bottom 0.406: E20.5 145.92,43.18 145.92,25.4 151.64,19.68 v151.64,15.88
!MD08  (via drill 0.81)
  Top 0.406: E45.12 32.26,48.26 30.99,46.99 v29.08,46.99 | v29.08,17.78 32.26,17.78 33.53,16.51 33.53,15.24 32.89,14.61 32.89,8.26 EDGE.DK1
  Bottom 0.406: v29.08,46.99 28.45,46.35 28.45,18.41 v29.08,17.78
!MD09  (via drill 0.81)
  Top 0.406: v39.88,67.94 43.05,71.12 E41.7 | v104.65,97.16 103.38,95.89 v58.93,95.89 | v32.26,15.88 31.62,15.24 30.35,15.24 29.72,14.61 29.72,8.26 EDGE.DL1
  Bottom 0.406: v39.88,67.94 39.88,42.55 E45.9 36.07,38.73 36.07,19.68 v32.26,15.88 | E32.10 104.65,107.31 v104.65,97.16 | v58.93,95.89 53.85,90.81 53.85,67.94 53.21,67.31 50.67,67.31 E41.7
!MD10  (via drill 0.81)
  Top 0.406: v30.35,16.51 29.08,15.24 27.81,15.24 | 27.81,15.24 27.18,15.24 26.54,14.61 26.54,8.26 EDGE.DM1 | v55.12,21.59 52.58,19.05 28.45,19.05 27.81,18.41 27.81,15.24
  Bottom 0.406: v30.35,16.51 E45.7 | E41.10 55.12,73.03 v55.12,21.59
!MD11  (via drill 0.81)
  Top 0.406: E36.9 84.96,74.93 77.98,74.93 76.71,73.66 E41.9 54.48,69.85 44.32,69.85 v42.42,67.94 | v24,36.83 E45.5 | EDGE.DP1 20.19,8.26 20.19,14.61 v21.46,15.88 25.91,20.32 41.15,20.32 v42.42,21.59
  Bottom 0.406: v24,36.83 21.46,34.29 v21.46,15.88 | v42.42,21.59 v42.42,67.94
!POWER_OK  (via drill 0.81)
  Top 0.406: v194.18,40.64 E16.9
  Bottom 0.406: v194.18,40.64 196.09,42.55 196.09,48.9 E11.2
!RDF  (via drill 0.81)
  Top 0.406: E4.13 E4.12 257.68,146.05 v212.6,146.05 | v151.64,62.23 v210.06,62.23
  Bottom 0.406: 151,74.93 151.64,75.56 151.64,107.31 E22.12 | 151,74.93 E21.9 | v212.6,146.05 210.06,143.51 v210.06,62.23 | v151.64,62.23 151,62.87 151,74.93
!RIB
  Top 0.406: E18.5 166.88,107.31 166.88,102.23 160.53,102.23 158.62,104.14 E22.10
  Bottom 0.406: E21.11 147.83,80.64 147.83,102.23 E22.10
!RIF  (via drill 0.81)
  Top 0.406: v163.07,111.76 159.26,107.95 151,107.95 E22.11
  Bottom 0.406: E21.10 146.56,79.38 146.56,102.87 149.73,106.05 E22.11 | E18.2 163.07,114.94 v163.07,111.76
!RMF  (via drill 0.81)
  Top 0.406: v23.37,134.62 E53.9 | v24,170.81 18.29,176.53 11.94,176.53 10.67,177.8 E54.4 | E24.5 143.38,176.53 v157.99,176.53 192.28,176.53 197.36,171.45 200.53,171.45 204.34,167.64 E15.9 | v159.26,101.6 E22.9 | v29.08,193.68 37.34,201.93 119.25,201.93 119.89,202.56 v140.84,202.56
  Bottom 0.406: v23.37,134.62 24,135.25 v24,170.81 29.08,175.9 v29.08,193.68 | E54.1 8.76,184.15 8.76,179.07 E54.4 | v159.26,101.6 159.26,120.02 157.99,121.28 v157.99,176.53 157.99,185.42 v140.84,202.56
!RTF  (via drill 0.81)
  Top 0.406: E29.8 130.05,169.54 140.21,169.54 141.48,168.28 v144.02,168.28 | E48.13 39.24,184.15 54.48,184.15 65.28,194.94 v138.94,194.94
  Bottom 0.406: v144.02,168.28 144.02,175.9 E24.4 144.65,180.34 144.65,186.06 141.48,189.23 141.48,192.41 v138.94,194.94
!RUN  (via drill 0.81)
  Top 0.406: v142.11,30.48 v171.32,30.48
  Bottom 0.406: E16.8 171.32,36.83 v171.32,30.48 | v142.11,30.48 140.21,28.57 140.21,8.26 EDGE.BU2
!SINT
  Top 0.406: E24.2 E24.1
  Bottom 0.406: E22.3 140.21,116.2 140.21,180.97 E24.2
!SKIP  (via drill 0.81)
  Top 0.406: v84.96,15.24 84.33,15.24 83.69,14.61 83.69,8.26 EDGE.CS1
  Bottom 0.406: E35.13 90.68,46.35 90.68,15.88 90.04,15.24 v84.96,15.24
!SUF
  Bottom 0.406: E22.5 145.29,112.39 145.29,144.15 E23.3
!TS1  (via drill 0.81)
  Top 0.406: v194.82,43.81 E11.6 | v187.2,56.52 165.61,56.52 163.7,58.42 v145.92,58.42 | v141.48,25.4 133.22,25.4 129.41,29.21 v102.11,29.21 | E39.6 61.47,137.79 61.47,134.62 69.09,134.62 70.36,133.35 v93.22,133.35
  Bottom 0.406: v194.82,43.81 187.2,51.44 v187.2,56.52 | v145.92,58.42 144.02,56.52 144.02,45.72 142.75,44.45 140.84,44.45 140.84,40.01 141.48,39.37 143.38,39.37 143.38,27.3 v141.48,25.4 | EDGE.CK2 102.11,8.26 102.11,14.61 101.47,15.24 101.47,26.67 102.11,27.3 v102.11,29.21 102.11,40.64 103.38,41.91 103.38,46.99 98.3,46.99 94.49,50.8 94.49,99.06 93.85,99.69 93.85,132.72 v93.22,133.35
!TS_DISABLE  (via drill 0.81)
  Top 0.762: E12.3 196.72,82.55 177.67,82.55 v177.04,81.92 | v175.77,95.89 155.45,95.89 154.81,95.25 137.03,95.25 135.76,96.52 v117.98,96.52 | v83.06,160.66 113.54,160.66 114.81,159.38 v117.35,159.38 | R5.1 131.95,190.5 J1.2
  Bottom 0.762: v177.04,81.92 175.77,83.19 v175.77,95.89 | v117.98,96.52 117.35,97.16 v117.35,159.38 117.35,187.32 J1.2 | E38.1 83.06,156.84 v83.06,160.66
!USER_MODE  (via drill 0.81)
  Top 0.406: v26.54,25.4 27.81,26.67 v64.64,26.67
  Bottom 0.406: E35.4 76.71,47.62 76.71,62.23 | 76.71,62.23 76.71,109.86 E37.4 | v26.54,25.4 26.54,8.26 EDGE.DM2 | v64.64,26.67 74.17,36.2 74.17,59.69 76.71,62.23
(D_IN+CIF+RMF)
  Top 0.406: E10.10 226.57,163.19 120.52,163.19 116.71,167 64.01,167 E44.9 57.02,173.99 29.72,173.99 23.37,180.34 E54.12
C1L  (via drill 0.81)
  Top 0.406: v116.71,19.68 115.44,18.41 112.9,18.41 109.09,14.61 109.09,8.26 EDGE.CH1
  Bottom 0.406: E26.4 119.25,76.2 119.25,27.94 116.71,25.4 v116.71,19.68
CINT  (via drill 0.81)
  Top 0.406: v144.02,197.49 76.07,197.49 75.44,198.12 67.18,198.12 54.48,185.42 E44.1
  Bottom 0.406: E24.11 151.64,179.71 151.64,189.87 v144.02,197.49
CPMA_DISABLE  (via drill 0.81)
  Top 0.406: E11.13 204.34,52.07 201.8,52.07 194.82,59.05 v193.55,59.05 | v189.1,113.03 192.91,116.84 E13.2
  Bottom 0.406: v193.55,59.05 189.1,63.5 v189.1,113.03
D  (via drill 0.81)
  Top 0.406: v68.45,53.34 E40.14 | v69.72,114.3 67.18,116.84 E42.13 | v207.52,99.69 117.98,99.69 115.44,102.23 98.3,102.23 90.04,110.49 v69.72,110.49
  Bottom 0.406: v68.45,53.34 69.72,54.61 v69.72,110.49 v69.72,114.3 | E14.9 207.52,137.79 v207.52,99.69
DB
  Top 0.406: E17.5 170.69,76.2 171.96,77.47 196.72,77.47 E12.5
DB_LOAD  (via drill 0.81)
  Top 0.406: v161.8,132.08 218.31,132.08 E9.6
  Bottom 0.406: E17.2 166.24,85.09 166.24,88.9 164.34,90.81 164.34,102.23 163.07,103.5 163.07,109.22 164.34,110.49 166.24,110.49 166.24,120.65 161.8,125.09 v161.8,132.08
DF0  (via drill 0.81)
  Top 0.406: v3.68,46.99 E50.6 | 4.32,107.95 9.4,113.03 16.38,113.03 E52.12 | 4.32,107.95 v3.68,107.31 | v216.41,81.28 E7.3 | v215.14,63.5 47.5,63.5 46.86,62.87 v3.68,62.87 | E49.7 29.08,102.87 15.75,102.87 10.67,107.95 4.32,107.95
  Bottom 0.406: v3.68,107.31 v3.68,62.87 v3.68,46.99 | E52.12 E52.13 | v216.41,81.28 215.14,80.01 v215.14,63.5
DF1  (via drill 0.81)
  Top 0.406: E50.10 16.38,36.83 16.38,31.75 v46.23,31.75 58.29,31.75 59.56,33.02 79.25,33.02 81.79,30.48 129.41,30.48 131.95,27.94 v216.41,27.94 | v47.5,103.5 39.88,103.5 E49.9 | E7.11 227.84,78.74 226.57,77.47 v216.41,77.47 | v41.15,135.89 43.05,133.99 v44.96,133.99
  Bottom 0.406: v46.23,31.75 48.13,33.66 48.13,52.07 48.77,52.7 48.77,85.09 47.5,86.36 v47.5,103.5 46.23,104.78 46.23,132.72 v44.96,133.99 | v216.41,27.94 v216.41,77.47 | E48.5 36.7,175.26 36.7,178.44 37.34,179.07 41.15,179.07 v41.15,135.89
DF2  (via drill 0.81)
  Top 0.406: E50.15 11.94,56.52 6.86,56.52 2.41,60.96 2.41,99.69 v20.83,99.69 22.73,99.69 | 22.73,99.69 30.99,99.69 E49.11 | E7.8 231.01,68.58 201.17,68.58 200.53,67.94 v193.55,67.94 | v190.37,93.98 172.59,93.98 171.96,94.61 159.26,94.61 156.72,92.08 156.08,92.71 137.03,92.71 133.86,89.53 102.74,89.53 101.47,88.27 78.61,88.27 73.53,93.34 35.43,93.34 34.16,94.61 27.81,94.61 22.73,99.69 | E48.9 33.53,168.28 29.72,168.28 27.81,170.18 27.81,174.62 24.64,174.62 v20.19,179.07
  Bottom 0.406: v193.55,67.94 190.37,71.12 v190.37,93.98 | v20.19,179.07 20.19,140.97 20.83,140.34 v20.83,99.69
DF_ENABLE  (via drill 0.81)
  Top 0.406: E14.5 185.29,142.24 v176.4,133.35 | v130.05,17.14 128.14,17.14 128.14,8.26 EDGE.CA1 | v168.78,22.86 v135.76,22.86 | v169.42,71.12 171.96,73.66 E17.9
  Bottom 0.406: E17.9 175.13,73.66 175.13,81.92 174.5,82.55 174.5,95.25 173.86,95.89 173.86,105.41 E18.9 175.13,109.22 175.13,132.08 v176.4,133.35 | v135.76,22.86 v130.05,17.14 | v168.78,22.86 170.05,24.13 170.05,39.37 166.24,43.18 166.24,51.44 169.42,54.61 v169.42,71.12
ERROR  (via drill 0.81)
  Top 0.406: E37.3 82.42,118.11 v90.04,118.11 | v90.04,181.61 88.77,182.88 E44.13
  Bottom 0.406: v90.04,181.61 v90.04,118.11
F  (via drill 0.81)
  Top 0.406: E46.2 36.07,89.53 v42.42,89.53 | v44.96,94.61 46.23,95.89 v52.58,95.89
  Bottom 0.406: v42.42,89.53 44.96,92.08 v44.96,94.61 | v52.58,95.89 57.02,100.33 57.02,105.41 E42.9
GND  (via drill 0.81)
  Top 0.762: EDGE.DF2 42.42,8.26 v42.42,15.88 50.04,15.88 50.67,15.24 | 50.67,15.24 51.31,14.61 51.31,8.26 EDGE.DC1 | 50.67,15.24 v51.31,15.88 55.12,19.68 v78.61,19.68 | v80.52,15.88 80.52,8.26 EDGE.CT2 | EDGE.CF2 112.27,8.26 v112.27,15.88 113.54,17.14 118.62,17.14 120.52,15.24 | 120.52,15.24 121.16,14.61 121.16,8.26 EDGE.CC1 | 120.52,15.24 v121.16,15.88 | E25.1 124.33,55.88 137.03,55.88 139.57,53.34 E20.1 | E30.6 101.47,43.18 E30.10 109.09,40.64 E25.6 124.33,43.18 | 124.33,43.18 E25.10 C26.2 | 124.33,43.18 125.6,44.45 | 125.6,44.45 E25.12 | 125.6,44.45 v124.33,45.72 | v111.63,24.13 110.36,25.4 C57.- 102.74,26.67 95.12,26.67 C35.2 v79.88,27.94 | E50.8 10.03,8.26 EDGE.DT2 | E45.6 32.26,42.55 37.34,42.55 E45.10 | C45.2 29.72,60.33 13.21,60.33 C50.2 v6.86,58.42 | E46.6 32.89,76.2 E46.10 | E52.7 12.57,101.6 E49.8 | C36.2 81.79,93.34 95.76,93.34 97.66,91.44 C32.2 | 94.49,52.7 95.12,53.34 E30.1 | 94.49,52.7 C58.2 | C40.2 55.12,55.24 91.95,55.24 94.49,52.7 | E39.7 64.64,135.89 69.72,135.89 70.36,135.25 76.07,135.25 77.98,137.16 E38.7 | v74.8,144.78 E39.11 | E32.1 98.3,120.02 88.14,120.02 86.87,121.28 80.52,121.28 E37.1 | C52.2 13.21,126.36 29.72,126.36 C47.2 | E49.3 E49.4 E49.13 39.24,111.76 50.04,122.56 | 50.04,122.56 C42.2 53.21,124.46 55.12,122.56 68.45,122.56 69.72,123.83 79.25,123.83 C37.2 | E36.1 76.71,88.27 52.58,88.27 E41.1 | EDGE.BF2 175.77,8.26 175.77,15.88 v179.58,15.88 183.39,15.88 184.66,14.61 184.66,8.26 EDGE.BC1 | v144.02,15.88 144.02,8.26 EDGE.BT2 | v156.72,40.01 158.62,38.1 E16.7 | v157.99,71.12 E17.7 | v144.65,24.77 145.29,24.13 166.24,24.13 C56.- 171.32,25.4 v174.5,22.23 | E22.8 141.48,102.23 123.7,102.23 E27.7
  Top 0.762: 166.88,90.81 168.15,89.53 192.91,89.53 194.18,90.81 198.63,90.81 C13.2 201.17,89.53 229.11,89.53 | 166.88,90.81 C19.2 | 166.88,90.81 v156.08,90.81 v142.75,90.81 | E2.13 E2.4 | E3.13 E3.4 | 229.11,89.53 C8.2 | 229.11,89.53 250.7,89.53 C3.2 | 199.26,41.91 200.53,40.64 E11.9 | 199.26,41.91 E11.5 | 199.26,41.91 204.34,46.99 | 204.34,46.99 E11.12 | C17.2 192.91,53.34 E11.1 204.34,46.99 | EDGE.AF2 245.62,8.26 v245.62,15.88 236.09,25.4 | v213.87,15.88 213.87,8.26 EDGE.AT2 | C1.2 246.25,25.4 236.09,25.4 | 236.09,25.4 C55.- 232.92,24.77 231.01,24.77 v222.76,16.51 | C12.2 200.53,57.15 203.07,57.15 204.34,55.88 223.39,55.88 E6.1 | C44.2 50.04,192.41 33.53,192.41 C49.2 30.35,191.77 17.65,191.77 17.02,192.41 13.21,192.41 C54.2 | E47.3 E47.4 E47.13 39.88,142.88 42.42,142.88 E43.7 | 66.55,159.38 77.98,159.38 C38.2 81.15,158.75 83.69,158.75 84.33,159.38 112.9,159.38 114.81,157.48 C29.2 | C39.2 66.55,159.38 | 51.31,159.38 C43.2 | 66.55,159.38 51.31,159.38 | 51.31,159.38 33.53,159.38 C48.2 22.73,157.48 20.83,159.38 13.21,159.38 C53.2 | v115.44,172.09 117.35,170.18 E29.7 | C33.2 102.11,122.56 121.16,122.56 C28.2 124.33,124.46 126.24,126.36 141.48,126.36 C23.2 | E19.7 163.07,135.25 144.02,135.25 E23.7 | 201.17,126.36 C14.2 | 201.17,126.36 225.3,126.36 C9.2 | E4.7 249.43,135.25 227.84,135.25 E9.7 | E14.12 E14.13 v200.53,149.86 | 224.03,187.32 C11.2 | 224.03,187.32 224.03,180.34 E10.3 E10.4 E10.13 239.9,177.8 C6.2 | C16.2 199.9,189.87 202.44,189.87 204.98,187.32 224.03,187.32 | C5.2 250.7,159.38 229.11,159.38 | C10.2 229.11,159.38 | C15.2 201.17,159.38 229.11,159.38 | E24.7 147.19,170.18 149.73,167.64 E15.8
  Top 0.762: C20.2 168.15,126.36 201.17,126.36 | v48.13,124.46 50.04,122.56
  Bottom 0.762: v42.42,15.88 42.42,8.26 EDGE.DF2 | v51.31,15.88 51.31,8.26 EDGE.DC1 | 78.61,27.94 v78.61,19.68 78.61,15.88 79.88,14.61 | 78.61,27.94 E35.7 | 79.88,14.61 79.88,8.26 EDGE.CT2 | v80.52,15.88 79.88,15.24 79.88,14.61 | EDGE.CF2 112.27,8.26 v112.27,15.88 111.63,16.51 v111.63,24.13 | v121.16,15.88 121.16,8.26 EDGE.CC1 | E26.7 E25.1 124.33,50.8 v124.33,45.72 | E21.7 E20.1 | 105.28,46.99 104.65,46.35 104.65,45.09 E30.10 104.01,40.64 C57.- | 105.28,46.99 E30.12 | v79.88,27.94 78.61,27.94 | EDGE.DT2 10.03,8.26 E50.8 6.86,38.73 v6.86,58.42 | E45.6 32.26,42.55 32.26,51.44 E45.1 31.62,54.61 C45.2 32.26,59.05 32.26,75.56 | E51.1 11.3,87.63 C51.2 11.3,102.87 E52.7 | 32.26,75.56 E46.6 | 32.26,75.56 32.26,84.45 E46.1 31.62,87.63 C46.2 31.62,100.33 E49.8 28.45,103.5 28.45,109.86 E49.4 | E36.1 79.88,87.63 C36.2 | 100.2,60.96 C31.2 98.93,57.15 E30.1 | 100.2,60.96 100.2,69.85 E31.7 100.84,73.03 100.84,90.81 C32.2 | E40.1 51.94,54.61 C40.2 | v74.8,144.78 76.71,142.88 76.71,139.06 E38.7 79.88,135.89 C37.2 79.88,120.65 E37.1 | C52.2 10.03,125.73 E53.8 | E47.8 30.35,125.73 C47.2 32.26,123.83 32.26,116.2 E49.3 | C41.2 51.94,87.63 E41.1 E42.7 52.58,106.05 52.58,120.02 51.94,120.65 C42.2 | 105.28,46.99 103.38,48.9 103.38,55.24 104.01,55.88 104.01,57.15 100.2,60.96 | 177.04,15.88 175.77,14.61 175.77,8.26 EDGE.BF2 | 177.04,15.88 v179.58,15.88 184.66,15.88 184.66,8.26 EDGE.BC1 | EDGE.BT2 144.02,8.26 v144.02,15.88 144.65,16.51 v144.65,24.77 | C18.2 165.61,59.05 165.61,70.48 E17.7 | E16.7 167.51,35.56 C56.- | 156.08,46.99 156.72,46.35 v156.72,40.01 | 156.08,46.99 C22.2 | 156.08,46.99 156.08,69.22 v157.99,71.12 155.45,73.66 155.45,90.17 v156.08,90.81
  Bottom 0.762: 177.04,15.88 174.5,18.41 v174.5,22.23 | E27.7 123.06,102.87 C27.2 | C19.2 165.61,92.08 165.61,103.5 E18.7 | E13.7 199.26,102.87 C13.2 | E22.8 142.75,100.97 v142.75,90.81 | E3.4 253.24,109.86 253.24,103.5 E3.8 252.6,100.33 C3.2 253.24,90.81 253.24,80.64 E2.4 253.24,76.83 253.24,70.48 E2.8 252.6,67.31 C2.2 253.24,57.78 253.24,37.47 E1.8 251.33,33.02 C1.2 252.6,25.4 254.51,23.5 254.51,8.26 EDGE.AC2 | E12.7 199.26,69.85 C12.2 197.99,57.15 E11.1 | E7.7 227.2,69.85 C7.2 225.93,57.15 E6.1 227.84,51.44 227.84,37.47 E6.8 225.93,24.77 227.2,23.5 233.55,23.5 C55.- | v245.62,15.88 245.62,8.26 EDGE.AF2 | EDGE.AT2 213.87,8.26 v213.87,15.88 222.76,15.88 v222.76,16.51 | C53.2 10.03,158.75 E54.7 11.94,172.09 11.94,189.87 C54.2 | E48.7 30.35,158.75 C48.2 32.26,156.84 32.26,149.22 E47.3 | E33.1 99.57,153.03 99.57,168.28 102.11,170.81 102.11,188.59 | C34.2 102.11,188.59 | 102.11,188.59 E34.1 83.06,185.42 83.06,177.16 77.98,172.09 77.98,159.38 C38.2 | C43.2 49.4,168.91 E44.7 | E39.1 64.64,153.67 C39.2 | C20.2 164.97,125.73 E19.7 166.88,139.06 166.88,156.84 C21.2 | E29.7 121.79,158.75 C29.2 123.7,156.84 123.7,139.06 E28.7 121.79,125.73 C28.2 | J1.1 115.44,179.07 v115.44,172.09 | C23.2 143.38,135.89 E23.7 | C4.2 251.33,125.73 E4.7 | E14.7 199.26,135.89 C14.2 | C24.2 142.11,158.75 142.11,166.37 | E24.7 142.11,166.37 | C30.2 137.03,195.58 138.3,196.85 142.11,196.85 142.11,193.68 143.38,192.41 C25.2 145.92,187.96 145.92,166.37 142.11,166.37 | E15.8 199.26,166.37 C15.2 199.9,156.84 199.9,150.5 v200.53,149.86 | C5.2 251.33,158.75 E5.7 | E15.1 199.26,186.69 C16.2 | E10.4 227.84,175.9 227.84,169.54 E10.8 227.2,166.37 C10.2 228.47,156.21 228.47,139.7 E9.7 227.2,135.89 C9.2 227.2,120.65 E8.1 227.84,117.47 227.84,92.08 C8.2
  Bottom 0.762: E43.7 v48.13,124.46
  pour Top (isolate 0.508): -0.13,214.63 265.3,214.63 265.3,15.24 -0.13,15.24
  pour Bottom (isolate 0.508): -0.13,214.63 265.3,214.63 265.3,15.24 -0.13,15.24
IB0
  Top 0.406: E10.7 229.74,173.99 257.68,173.99 E5.9
IB1  (via drill 0.81)
  Top 0.406: E5.5 v235.46,175.26
  Bottom 0.406: E10.9 235.46,169.54 v235.46,175.26
IB2
  Top 0.406: E10.11 238,168.28 255.14,168.28 258.32,171.45 259.59,171.45 260.22,172.09 260.22,176.53 257.68,176.53 E5.2
IF0
  Top 0.406: E6.6 232.28,46.99 234.82,46.99 241.17,53.34 E1.1
  Bottom 0.406: E2.7 249.43,69.22 249.43,55.88 251.33,53.98 E1.1
IF1
  Top 0.406: E6.10 236.09,40.64 E1.6 255.14,36.83 264.67,36.83 264.67,64.77 263.4,66.04 261.49,66.04 E2.9
IF2
  Top 0.406: E6.15 237.36,54.61 253.87,54.61 257.05,51.44 257.05,44.45 259.59,44.45 260.22,43.81 260.22,41.91 258.32,41.91 257.68,41.27 257.68,38.1 E1.10
  Bottom 0.406: E2.11 260.86,71.75 260.86,40.01 E1.10
IND1L  (via drill 0.81)
  Top 0.406: v107.82,57.78 108.46,58.42 v138.94,58.42
  Bottom 0.406: E30.14 107.82,54.61 v107.82,57.78 | v138.94,58.42 138.94,78.11 E21.3
IND2L  (via drill 0.81)
  Top 0.406: v111.63,50.8 E30.13 | v140.21,59.69 v112.9,59.69
  Bottom 0.406: v111.63,50.8 112.9,52.07 v112.9,59.69 | v140.21,59.69 140.21,74.3 E21.5
INDH  (via drill 0.81)
  Top 0.406: E19.3 168.78,143.51 v211.96,143.51 | E7.6 v211.33,73.66
  Bottom 0.406: v211.96,143.51 211.33,142.88 v211.33,73.66
INITIALIZE  (via drill 0.81)
  Top 0.406: v63.37,21.59 80.52,21.59 86.23,15.88 86.23,8.26 EDGE.CR1
  Bottom 0.406: E40.12 63.37,43.18 v63.37,21.59
INT_IN_PROG_MAMS_LD_CTL  (via drill 0.81)
  Top 0.406: E47.10 45.59,137.16 47.5,135.25 55.75,135.25 58.93,138.43 58.93,146.05 64.64,146.05 E39.14 | v179.58,73.66 196.09,73.66 197.36,74.93 199.9,74.93 204.98,80.01 238.63,80.01 243.71,85.09 253.87,85.09 261.49,92.71 261.49,104.14 E3.10 | v71.63,184.15 79.88,192.41 v166.88,192.41
  Bottom 0.406: E16.11 175.77,48.9 175.77,69.85 178.94,73.03 | v179.58,73.66 178.94,73.03 | E39.14 71.63,153.03 v71.63,184.15 | v166.88,192.41 178.94,180.34 178.94,73.03
INT_IN_PROGRESS
  Bottom 0.406: E39.10 69.09,144.15 69.09,147.96 E39.13
INT_INH  (via drill 0.81)
  Top 0.406: E26.8 E26.9 123.7,73.66 122.43,74.93 v115.44,74.93 | E50.1 8.13,55.24 6.86,55.24 1.14,60.96 1.14,129.54 25.27,129.54 25.91,128.91 v54.48,128.91 | E43.5 49.4,143.51 56.39,143.51 57.02,142.88 57.02,137.79 56.39,137.79 E43.8 | v114.17,100.97 98.3,100.97 91.31,107.95 65.91,107.95 63.37,110.49 v57.02,110.49
  Bottom 0.406: 55.12,129.54 55.75,130.18 E43.8 | 55.12,129.54 v54.48,128.91 | v115.44,74.93 115.44,94.61 114.17,95.89 v114.17,100.97 | v57.02,110.49 55.12,112.39 55.12,129.54
IO_PAUSE  (via drill 0.81)
  Top 0.406: E20.6 145.29,40.64 147.83,43.18 | 147.83,43.18 E20.10 E20.11 | 147.83,43.18 144.65,43.18 E20.4 140.21,45.72 133.86,52.07 128.78,52.07 124.97,48.26 E25.3 v115.44,48.26 | E45.4 E45.11 v41.15,45.72 | v96.39,109.22 E32.6 | v95.76,144.78 E33.4 E33.11 | v41.15,99.69 42.42,100.97 v96.39,100.97 | v114.17,92.71 112.27,94.61 v97.03,94.61
  Bottom 0.406: E33.12 E33.11 | E34.6 100.2,173.99 100.2,175.9 99.57,176.53 95.76,176.53 v95.76,144.78 96.39,144.15 v96.39,109.22 v96.39,100.97 96.39,100.33 97.03,99.69 v97.03,94.61 | v41.15,99.69 v41.15,45.72 | v115.44,48.26 114.17,49.53 v114.17,92.71
IOT000000XXX  (via drill 0.81)
  Top 0.406: E31.8 E31.9 110.36,77.47 124.97,77.47 127.51,74.93 144.02,74.93 149.1,69.85 157.35,69.85 158.62,68.58 v180.21,68.58 | E34.3 102.74,184.15 120.52,184.15 | E29.1 120.52,184.15 | E29.10 123.06,181.61 123.06,184.15 120.52,184.15
  Bottom 0.406: v180.21,68.58 183.39,71.75 183.39,139.7 181.48,141.6 181.48,179.71 156.08,205.1 121.79,205.1 E29.1
IOT010XXX0XX  (via drill 0.81)
  Top 0.406: E31.12 E31.11 | E33.3 100.2,146.05 v113.54,146.05 124.33,146.05 128.14,142.24 E28.10
  Bottom 0.406: E28.13 128.14,148.59 128.14,143.51 E28.10 | E31.12 108.46,83.19 108.46,104.14 113.54,109.22 v113.54,146.05
IOT010XXX1XX
  Top 0.406: E31.5 E31.6
  Bottom 0.406: E31.3 E31.2 97.66,85.09 | E32.3 97.66,113.03 97.66,100.33 98.3,99.69 98.3,87.63 97.66,87 97.66,85.09 | E31.5 97.66,77.47 97.66,85.09
IR01
  Bottom 0.406: E46.12 36.7,82.55 36.7,85.09 E46.14
JMP+JMS  (via drill 0.81)
  Top 0.406: v42.42,109.22 50.04,116.84 E42.2 | E42.2 E42.1 | E42.11 53.21,116.84 E42.2
  Bottom 0.406: E46.13 39.88,85.72 39.88,104.78 41.15,106.05 | 41.15,106.05 42.42,107.31 v42.42,109.22 | E48.11 39.88,175.9 39.88,125.09 41.15,123.83 41.15,106.05
LA  (via drill 0.81)
  Top 0.406: v163.07,60.96 v130.05,60.96 | E39.5 69.09,142.24 70.36,140.97 v109.73,140.97 | v109.73,168.28 138.94,168.28 141.48,165.74 v160.53,165.74 | E19.4 E19.5
  Bottom 0.406: E16.3 E16.2 164.97,51.44 166.24,52.7 166.24,53.98 165.61,54.61 | E25.14 130.05,53.98 v130.05,60.96 | v163.07,60.96 164.34,59.69 164.34,55.88 165.61,54.61 | v109.73,168.28 v109.73,140.97 | v160.53,165.74 163.7,162.56 163.7,146.05 E19.4 | 165.61,54.61 168.15,57.15 168.15,120.02 163.07,125.09 163.07,140.34 E19.5
LOAD_ADDR  (via drill 0.81)
  Top 0.406: v131.32,25.4 128.14,22.23 98.93,22.23 98.3,21.59 v88.14,21.59 | v80.52,29.84 78.61,31.75 v62.1,31.75 60.83,30.48 23.37,30.48 v17.02,24.13
  Bottom 0.406: E25.9 131.32,38.73 v131.32,25.4 | v88.14,21.59 80.52,29.21 v80.52,29.84 | v62.1,31.75 60.2,33.66 60.2,43.81 E40.11 | v17.02,24.13 17.02,8.26 EDGE.DR2
LOAD_CNTL  (via drill 0.81)
  Top 0.406: E11.4 197.36,45.09 187.2,45.09 v184.02,41.91
  Bottom 0.406: v184.02,41.91 172.59,30.48 172.59,8.26 EDGE.BH2
LOAD_CNTLH  (via drill 0.81)
  Top 0.406: E16.5 163.7,41.91 156.08,41.91 155.45,41.27 151,41.27 150.37,41.91 147.83,41.91 145.29,39.37 v137.03,39.37
  Bottom 0.406: v137.03,39.37 133.86,42.55 133.86,78.74 131.32,81.28 131.32,102.23 E27.8
MD03  (via drill 0.81)
  Top 0.406: v81.79,83.82 83.06,85.09 v102.74,85.09 | E11.14 201.8,53.34 194.82,60.33 164.34,60.33 163.7,59.69 v154.18,59.69 | v154.18,97.16 152.91,98.42 v101.47,98.42 | E32.4 101.47,111.76 v102.11,112.39 | E27.1 120.52,118.11 v102.11,118.11 | E34.4 103.38,173.35 v103.38,169.54
  Bottom 0.406: E36.4 81.79,81.92 v81.79,83.82 | v102.74,85.09 102.11,85.72 102.11,95.89 101.47,96.52 v101.47,98.42 101.47,110.49 102.11,111.12 v102.11,112.39 v102.11,118.11 102.11,136.53 100.84,137.79 | E33.6 100.84,137.79 | v154.18,97.16 v154.18,59.69 | v103.38,169.54 100.84,167 100.84,137.79
MD03L  (via drill 0.81)
  Top 0.406: v62.74,109.22 E42.10 | v62.74,126.36 64.64,128.27 v123.7,128.27
  Bottom 0.406: v62.74,126.36 v62.74,109.22 | v123.7,128.27 124.97,127 124.97,120.02 E27.2
MD04  (via drill 0.81)
  Top 0.406: E34.9 110.36,176.53 126.24,176.53 v127.51,175.26 | v128.14,161.93 128.78,161.29 v164.97,161.29 | v170.05,109.22 171.32,107.95 v185.93,107.95 | v184.66,45.72 180.85,41.91 v171.32,41.91 | v168.78,50.8 167.51,52.07 163.7,52.07 160.53,55.24 153.54,55.24 150.37,52.07 143.38,52.07 E20.2
  Bottom 0.406: v127.51,175.26 128.14,174.62 v128.14,161.93 | v164.97,161.29 168.78,157.48 168.78,120.65 170.05,119.38 v170.05,109.22 | v185.93,107.95 185.93,46.99 v184.66,45.72 | v171.32,41.91 168.78,44.45 v168.78,50.8
MD05  (via drill 0.81)
  Top 0.406: v152.91,105.41 124.97,105.41 122.43,107.95 100.2,107.95 E32.5
  Bottom 0.406: E32.5 100.84,111.12 100.84,121.28 97.66,124.46 97.66,140.97 E33.5 98.93,142.88 97.03,144.78 97.03,173.35 E34.5 | E20.13 152.91,53.98 v152.91,105.41
MD06  (via drill 0.81)
  Top 0.406: v137.67,114.94 E22.1 | v140.21,55.24 147.83,55.24 E20.14 | v3.05,159.38 E53.1 | v141.48,134.62 110.36,134.62 v109.73,133.99